# Altium schematic sheet BPCover.SchDoc
size A3; ApprovedBy: Siz Değerli Öğrenciler; CheckedBy: UDEMY; Organization: Altium Limited; Address1: L3, 12a Rodborough Rd; Address2: Frenchs Forest; Address3: NSW; Address4: Australia 2086; Revision: AA; SheetNumber: 1; SheetTotal: 5; PreparedBy: M. Berk AYDOĞAN; ProjectDescription: Wireless Security Detector
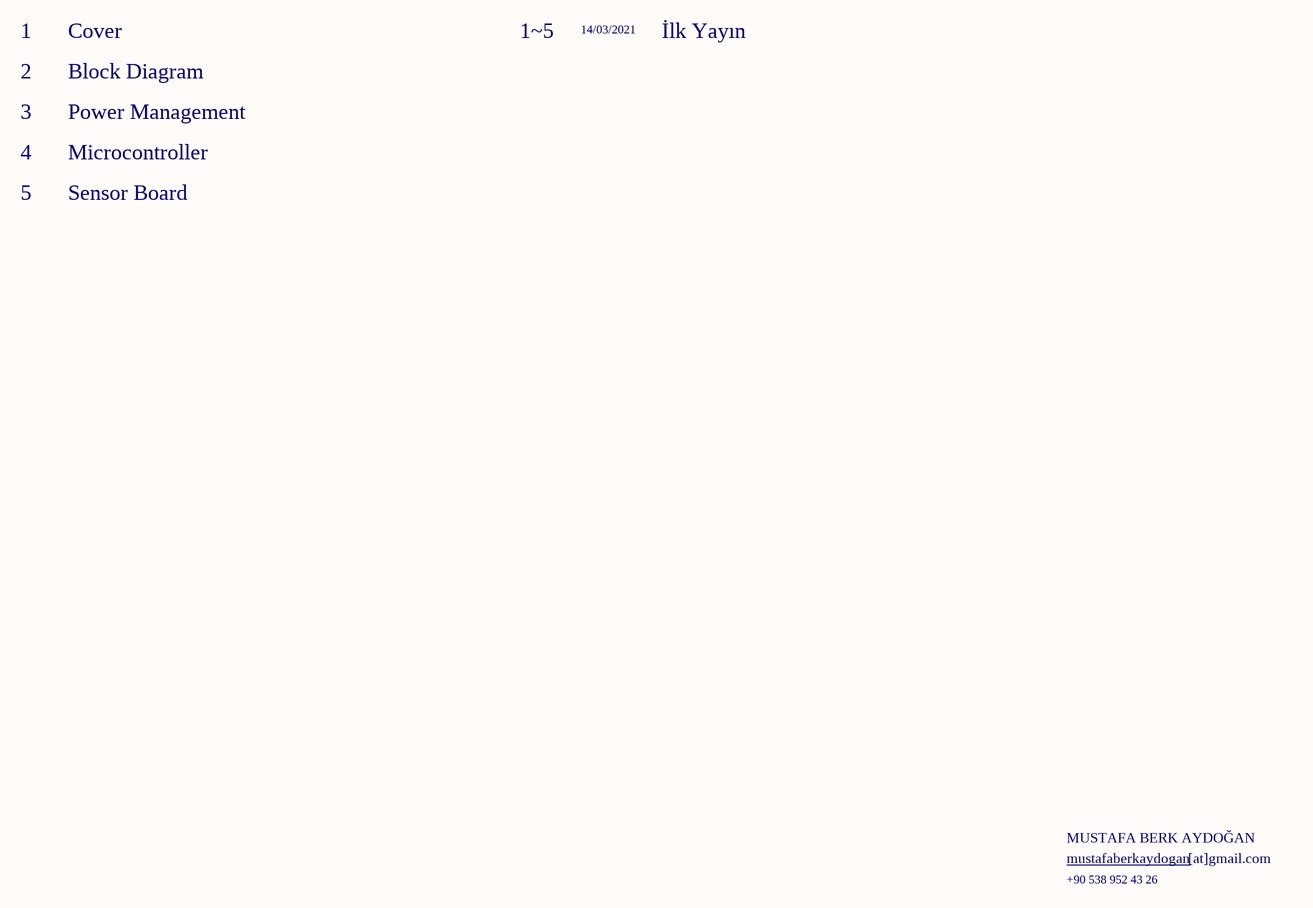
[diagram p0: BPCover.SchDoc]

## Notes on the sheet
- 1
- Cover
- 1~5
- 14/03/2021
- İlk Yayın
- 2
- Block Diagram
- 3
- 4
- Power Management
- Microcontroller
- 5
- Sensor Board
- MUSTAFA BERK AYDOĞAN
- mustafaberkaydogan
- +90 538 952 43 26
- [at]gmail.com
- Dosya Adı:
- Hazırlayan:
- Yayın Tariihi
- Kontrol Eden
- Değiştirilme Tarihi
- Onaylayan
- Revizyon
- Hardware Design Engineering
- Bölüm
- Boyut
- A3
- Sayfa